# Altium schematic sheet Sheet1.SchDoc
size A3; SheetNumber: 1; SheetTotal: 1
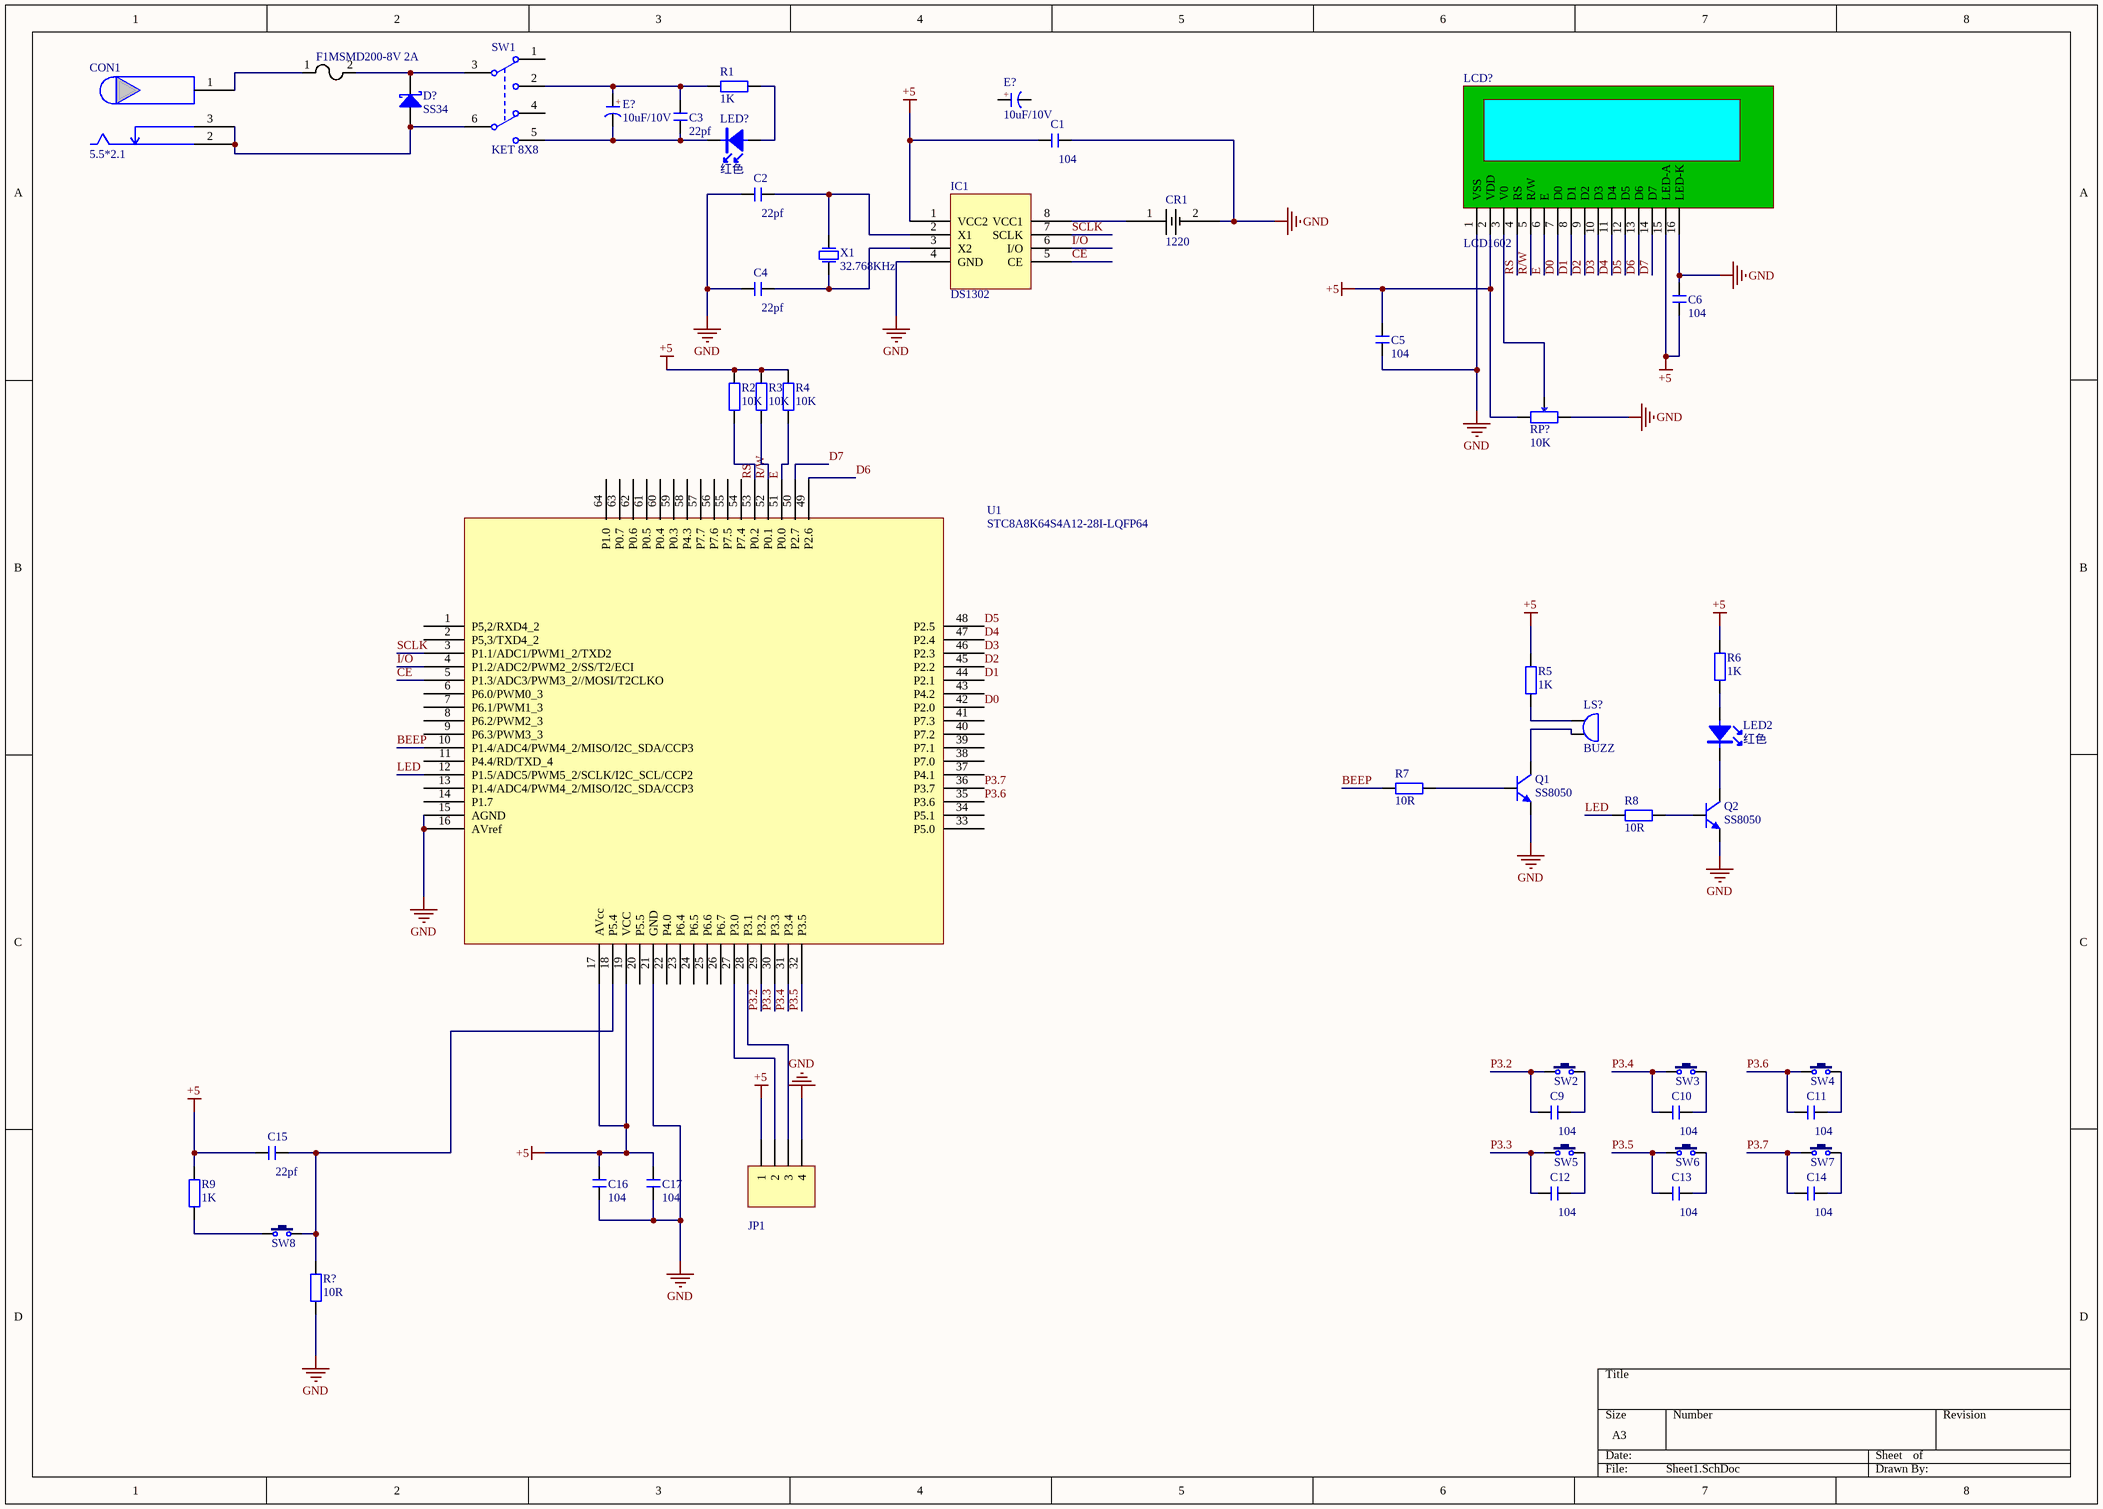
[diagram p0: Sheet1.SchDoc]

## Parts
(Parts that share a designator on the sheet are numbered #1, #2 ... from top to bottom, then left to right.)
?  JP1  [HDR1X4]
C1  104  [C 0805_L]
C2  22pf  [C 0805_L]
C3  22pf  [C 0805_L]
C4  22pf  [C 0805_L]
C5  104  [C 0805_L]
C6  104  [C 0805_L]
C9  104  [C 0805_L]
C10  104  [C 0805_L]
C11  104  [C 0805_L]
C12  104  [C 0805_L]
C13  104  [C 0805_L]
C14  104  [C 0805_L]
C15  22pf  [C 0805_L]
C16  104  [C 0805_L]
C17  104  [C 0805_L]
CON1  5.5*2.1  [CON]
CR1  1220
D?  SS34  [SMC]
E?#1  10uF/10V  [CT 8*12 - C]
E?#2  10uF/10V  [CT 8*12 - C]
F1MSMD200-8V_2A  (no value)
IC1  DS1302  [SOP8_M]
LCD?  LCD1602  [LCD-1602]
LED2  红色  [LED 0805G]
LED?  红色  [LED 0805G]
LS?  BUZZ  [BEEP 5x9x5.5]
Q1  SS8050  [SOT23-3N]
Q2  SS8050  [SOT23-3N]
R1  1K  [R 0805_L]
R2  10K  [R 0805_L]
R3  10K  [R 0805_L]
R4  10K  [R 0805_L]
R5  1K  [R 0805_L]
R6  1K  [R 0805_L]
R7  10R  [R 0805_L]
R8  10R  [R 0805_L]
R9  1K  [R 0805_L]
R?  10R  [R 0805_L]
RP?  10K  [3306W]
SW1  KET 8X8  [KFT DIP-8X8]
SW2  3x6x5  [TSW SMD-3*6*2.5]  (value not drawn)
SW3  3x6x5  [TSW SMD-3*6*2.5]  (value not drawn)
SW4  3x6x5  [TSW SMD-3*6*2.5]  (value not drawn)
SW5  3x6x5  [TSW SMD-3*6*2.5]  (value not drawn)
SW6  3x6x5  [TSW SMD-3*6*2.5]  (value not drawn)
SW7  3x6x5  [TSW SMD-3*6*2.5]  (value not drawn)
SW8  3x6x5  [TSW SMD-3*6*2.5]  (value not drawn)
U1  STC8A8K64S4A12-28I-LQFP64  [CQFP64P1522X1522X310-64N]
X1  32.768KHz  [OSC HC-49S]

## Nets
+5: ?.1 C1.1 C5.1 C6.2 C15.1 C16.2 C17.2 IC1.1(VCC2) LCD?.2(VDD) LCD?.15(LED-A) R2.2 R3.2 R4.2 R5.2 R6.2 R9.1 RP?.1 U1.17(AVcc) U1.19(VCC)
GND: ?.4 C1.2 C2.1 C4.1 C5.2 C6.1 C16.1 C17.1 CR1.2 IC1.4(GND) LCD?.1(VSS) LCD?.16(LED-K) Q1.2(E) Q2.2(E) R?.2 RP?.3 U1.15(AGND) U1.16(AVref) U1.21(GND)
BEEP: R7.2 U1.10(P1.4/ADC4/PWM4_2/MISO/I2C_SDA/CCP3)
CE: IC1.5(CE) U1.5(P1.3/ADC3/PWM3_2//MOSI/T2CLKO)
D0: LCD?.7(D0) U1.42(P2.0)
D1: LCD?.8(D1) U1.44(P2.1)
D2: LCD?.9(D2) U1.45(P2.2)
D3: LCD?.10(D3) U1.46(P2.3)
D4: LCD?.11(D4) U1.47(P2.4)
D5: LCD?.12(D5) U1.48(P2.5)
D6: LCD?.13(D6) U1.49(P2.6)
D7: LCD?.14(D7) U1.50(P2.7)
E: LCD?.6(E) R4.1 U1.51(P0.0)
I/O: IC1.6(I/O) U1.4(P1.2/ADC2/PWM2_2/SS/T2/ECI)
LED: R8.2 U1.12(P1.5/ADC5/PWM5_2/SCLK/I2C_SCL/CCP2)
P3.2: C9.1 SW2.1 U1.29(P3.2)
P3.3: C12.1 SW5.1 U1.30(P3.3)
P3.4: C10.1 SW3.1 U1.31(P3.4)
P3.5: C13.1 SW6.1 U1.32(P3.5)
P3.6: C11.1 SW4.1 U1.35(P3.6)
P3.7: C14.1 SW7.1 U1.36(P3.7)
R/W: LCD?.5(R/W) R3.1 U1.52(P0.1)
RS: LCD?.4(RS) R2.1 U1.53(P0.2)
SCLK: IC1.7(SCLK) U1.3(P1.1/ADC1/PWM1_2/TXD2)
Net?_2: ?.2 U1.27(P3.0)
Net?_3: ?.3 U1.28(P3.1)
NetC2_2: C2.2 IC1.2(X1) X1.2
NetC3_1: C3.1 E?#1.2(K) LED?.2(K) SW1.5(COM2)
NetC3_2: C3.2 E?#1.1(A) R1.1 SW1.2(COM2)
NetC4_2: C4.2 IC1.3(X2) X1.1
NetC9_2: C9.2 SW2.2
NetC10_2: C10.2 SW3.2
NetC11_2: C11.2 SW4.2
NetC12_2: C12.2 SW5.2
NetC13_2: C13.2 SW6.2
NetC14_2: C14.2 SW7.2
NetC15_2: C15.2 R?.1 SW8.2 U1.18(P5.4)
NetCON1_1: CON1.1 F1MSMD200-8V_2A.1
NetCON1_2: CON1.2 CON1.3 D?.1(A) SW1.6(NC2)
NetCR1_1: CR1.1 IC1.8(VCC1)
NetD?_2: D?.2(K) F1MSMD200-8V_2A.2 SW1.3(NO1)
NetLCD?_3: LCD?.3(V0) RP?.2
NetLED2_1: LED2.1(A) R6.1
NetLED2_2: LED2.2(K) Q2.3(C)
NetLED?_1: LED?.1(A) R1.2
NetLS?_1: LS?.1 R5.1
NetLS?_2: LS?.2 Q1.3(C)
NetQ1_1: Q1.1(B) R7.1
NetQ2_1: Q2.1(B) R8.1
NetR9_2: R9.2 SW8.1

Not connected (* = marked no-connect by the designer): E?#2 1(A) 2(K); SW1 1(NC1) 4(NO2); U1 1(P5,2/RXD4_2) 2(P5,3/TXD4_2) 6(P6.0/PWM0_3) 7(P6.1/PWM1_3) 8(P6.2/PWM2_3) 9(P6.3/PWM3_3) 11(P4.4/RD/TXD_4) 13(P1.4/ADC4/PWM4_2/MISO/I2C_SDA/CCP3) 14(P1.7) 20(P5.5) 22(P4.0) 23(P6.4) 24(P6.5) 25(P6.6) 26(P6.7) 33(P5.0) 34(P5.1) 37(P4.1) 38(P7.0) 39(P7.1) 40(P7.2) 41(P7.3) 43(P4.2) 54(P7.4) 55(P7.5) 56(P7.6) 57(P7.7) 58(P4.3) 59(P0.3) 60(P0.4) 61(P0.5) 62(P0.6) 63(P0.7) 64(P1.0)

## Notes on the sheet
- (in symbol CS_SMD) +

## Library data of the parts
? = Header 4: Header, 4-Pin; LatestRevisionDate: 17-Jul-2002; LatestRevisionNote: Re-released for DXP Platform.; Publisher: Altium Limited
C1-C6 C9-C17 = C: 贴片电容; 淘宝ID: 小糖豆的小窝窝; BOM名称: 贴片电容; 下单链接: https://item.taobao.com/item.htm?ft=t&id=613637044352
CON1 = CON1
CR1 = CR1
D? = SS34: 肖特基二极管; 淘宝ID: 小糖豆的小窝窝; BOM名称: 肖特基二极管; 下单链接: https://item.taobao.com/item.htm?ft=t&id=613637044352
E?#1 E?#2 = CS_SMD: 贴片固态电容; 淘宝ID: 小糖豆的小窝窝; BOM名称: 贴片固态电容; 下单链接: https://item.taobao.com/item.htm?ft=t&id=613637044352
F1MSMD200-8V_2A = F1MSMD200-8V 2A
LCD? = LCD1602: 淘宝ID: 小糖豆的小窝窝; BOM名称: LCD 1602; 下单链接: https://item.taobao.com/item.htm?ft=t&id=613637044352
LED2 LED? = LED-SMD: 贴片LED; 淘宝ID: 小糖豆的小窝窝; BOM名称: 贴片LED; 下单链接: https://item.taobao.com/item.htm?ft=t&id=613637044352
LS? = BUZZ: 蜂鸣器; 淘宝ID: 小糖豆的小窝窝; BOM名称: 蜂鸣器; 下单链接: https://item.taobao.com/item.htm?ft=t&id=613637044352
Q1 Q2 = 8050-SMD: 高频放大-NPN型; 淘宝ID: 小糖豆的小窝窝; BOM名称: 高频放大-NPN型; 下单链接: https://item.taobao.com/item.htm?ft=t&id=613637044352
R1-R9 R? = R: 贴片电阻; 淘宝ID: 小糖豆的小窝窝; BOM名称: 贴片电阻; 下单链接: https://item.taobao.com/item.htm?ft=t&id=613637044352
RP? = RP: 单联电位器; 淘宝ID: 小糖豆的小窝窝; BOM名称: 单联电位器; 下单链接: https://item.taobao.com/item.htm?ft=t&id=613637044352
SW1 = KET 8X8: 8*8自锁开关; 淘宝ID: 小糖豆的小窝窝; BOM名称: 8*8自锁开关; 下单链接: https://item.taobao.com/item.htm?ft=t&id=613637044352
SW2-SW8 = TSW 3x6: 3x6轻触开关; 淘宝ID: 小糖豆的小窝窝; BOM名称: 3x6轻触开关; 下单链接: https://item.taobao.com/item.htm?ft=t&id=613637044352
X1 = XTAL-2P: 2脚无源脚晶振; 淘宝ID: 小糖豆的小窝窝; BOM名称: 2脚无源脚晶振; 下单链接: https://item.taobao.com/item.htm?ft=t&id=613637044352